# Altium schematic sheet Controller.SchDoc
size A; SheetNumber: 2; SheetTotal: 4
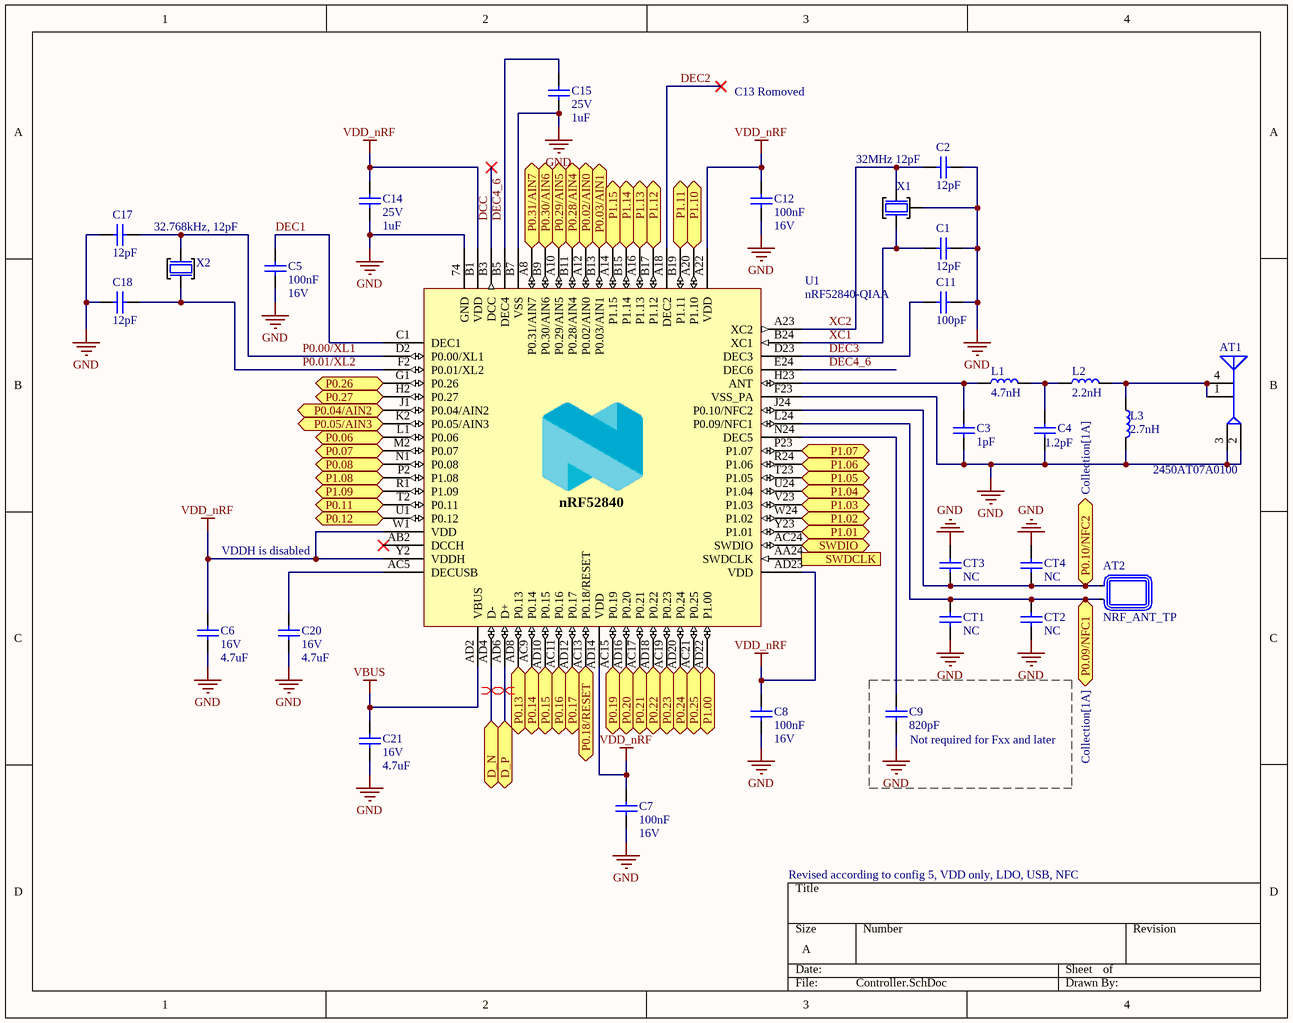
[diagram p0: Controller.SchDoc]

## Parts
AT1  2450AT07A0100  [2450AT07A0100-Footprint-1]
AT2  NRF_ANT_TP  [NRF_ANT_TP-Footprint-1]
C1  value 12pF  [0402_C]  (hidden comment: 12pF (120) 5% 50V)
C2  value 12pF  [0402_C]  (hidden comment: 12pF (120) 5% 50V)
C3  value 1pF  [0402_C]  (hidden comment: 1pF (1R0) 0.25pF 50V)
C4  value 1.2pF  [0402_C]  (hidden comment: 1.2pF (1R2) 50V)
C5  value 100nF  Voltage: 16V  [0402_C]  (hidden comment: 100nF (104) 10% 16V)
C6  value 4.7uF  Voltage: 16V  [0603_C]  (hidden comment: 4.7uF (475) 10% 16V)
C7  value 100nF  Voltage: 16V  [0402_C]  (hidden comment: 100nF (104) 10% 16V)
C8  value 100nF  Voltage: 16V  [0402_C]  (hidden comment: 100nF (104) 10% 16V)
C9  value 820pF  [0402_C]  (hidden comment: 820pF (821) 10% 50V)
C11  value 100pF  [0402_C]  (hidden comment: 100pF (101) 5% 50V)
C12  value 100nF  Voltage: 16V  [0402_C]  (hidden comment: 100nF (104) 10% 16V)
C14  value 1uF  Voltage: 25V  [0402_C]  (hidden comment: 1uF (105) 10% 25V)
C15  value 1uF  Voltage: 25V  [0402_C]  (hidden comment: 1uF (105) 10% 25V)
C17  value 12pF  [0402_C]  (hidden comment: 12pF (120) 5% 50V)
C18  value 12pF  [0402_C]  (hidden comment: 12pF (120) 5% 50V)
C20  value 4.7uF  Voltage: 16V  [0603_C]  (hidden comment: 4.7uF (475) 10% 16V)
C21  value 4.7uF  Voltage: 16V  [0603_C]  (hidden comment: 4.7uF (475) 10% 16V)
CT1  NC  [0402_C]
CT2  NC  [0402_C]
CT3  NC  [0402_C]
CT4  NC  [0402_C]
L1  4.7nH  [0402_L]
L2  2.2nH  [0402_L]
L3  2.7nH  [0402_L]
U1  nRF52840-QIAA  [AQFN50P700X700X85_HS-74N]
X1  32MHz 12pF  [XTAL_2016_4P]
X2  32.768kHz, 12pF  [XTAL_2012_2P]

## Blocks framed on the sheet
Not required for Fxx and later: C9

## Ports
D_N (bidir, see Collection[2D]), D_P (bidir, see Collection[2D]), P0.02/AIN0 (bidir, see Collection[1A]), P0.03/AIN1 (bidir, see Collection[1A]), P0.04/AIN2 (bidir, see Collection[1A]), P0.05/AIN3 (bidir, see Collection[1A]), P0.06 (bidir, see Collection[1A], Interface[4C]), P0.07 (bidir, see Collection[1A]), P0.08 (bidir, see Collection[1A], Interface[2C]), P0.09/NFC1 (bidir, see Collection[1A]), P0.10/NFC2 (bidir, see Collection[1A]), P0.11 (bidir, see Collection[1A]), P0.12 (bidir, see Collection[1A]), P0.13 (bidir, see Collection[1A]), P0.14 (bidir, see Collection[1B]), P0.15 (bidir, see Collection[1B]), P0.16 (bidir, see Collection[1B]), P0.17 (bidir, see Collection[1B]), P0.18/RESET (bidir, see Collection[2D], Interface[1D]), P0.19 (bidir, see Collection[1B]), P0.20 (bidir, see Collection[1B]), P0.21 (bidir, see Collection[1B]), P0.22 (bidir, see Collection[1B]), P0.23 (bidir, see Collection[1B]), P0.24 (bidir, see Collection[1B]), P0.25 (bidir, see Collection[1B]), P0.26 (bidir, see Collection[1B], Interface[4C]), P0.27 (bidir, see Collection[1B]), P0.28/AIN4 (bidir, see Collection[1B]), P0.29/AIN5 (bidir, see Collection[1B]), P0.30/AIN6 (bidir, see Collection[1B]), P0.31/AIN7 (bidir, see Collection[1B]), P1.00 (bidir, see Collection[1C]), P1.01 (bidir, see Collection[1C]), P1.02 (bidir, see Collection[1C]), P1.03 (bidir, see Collection[1C]), P1.04 (bidir, see Collection[1C]), P1.05 (bidir, see Collection[1C]), P1.06 (bidir, see Collection[1C]), P1.07 (bidir, see Collection[1C]), P1.08 (bidir, see Collection[1C]), P1.09 (bidir, see Collection[1C]), P1.10 (bidir, see Collection[1C]), P1.11 (bidir, see Collection[1C]), P1.12 (bidir, see Collection[1C]), P1.13 (bidir, see Collection[1C]), P1.14 (bidir, see Collection[1C], Interface[2D]), P1.15 (bidir, see Collection[1C]), SWDCLK (in, see Collection[2D], Interface[4C]), SWDIO (bidir, see Collection[2D], Interface[4C])

## Nets
GND: AT1.2 AT1.3 C1.2 C2.2 C3.1 C4.1 C5.1 C6.1 C7.1 C8.1 C9.1 C11.2 C12.1 C14.1 C15.1 C17.1 C18.1 C20.1 C21.1 CT1.1 CT2.1 CT3.2 CT4.2 L3.2 U1.74(GND) U1.B7(VSS) U1.F23(VSS_PA) X1.2(GND)
VBUS: C21.2 U1.AD2(VBUS)
VDD_nRF: C6.2 C7.2 C8.2 C12.2 C14.2 U1.A22(VDD) U1.AD14(VDD) U1.AD23(VDD) U1.B1(VDD) U1.W1(VDD) U1.Y2(VDDH)
D_N: U1.AD4(D-) ; port D_N
D_P: U1.AD6(D+) ; port D_P
DCC: U1.B3(DCC)
DEC1: C5.2 U1.C1(DEC1)
DEC2: U1.A18(DEC2)
DEC3: C11.1 U1.D23(DEC3)
DEC4_6: C15.2 U1.B5(DEC4) U1.E24(DEC6)
P0.00/XL1: C17.2 U1.D2(P0.00/XL1) X2.2(OUT)
P0.01/XL2: C18.2 U1.F2(P0.01/XL2) X2.1(IN)
P0.02/AIN0: U1.A12(P0.02/AIN0) ; port P0.02/AIN0
P0.03/AIN1: U1.B13(P0.03/AIN1) ; port P0.03/AIN1
P0.04/AIN2: U1.J1(P0.04/AIN2) ; port P0.04/AIN2
P0.05/AIN3: U1.K2(P0.05/AIN3) ; port P0.05/AIN3
P0.06: U1.L1(P0.06) ; port P0.06
P0.07: U1.M2(P0.07) ; port P0.07
P0.08: U1.N1(P0.08) ; port P0.08
P0.09/NFC1: AT2.2 CT1.2 CT2.2 U1.L24(P0.09/NFC1) ; port P0.09/NFC1
P0.10/NFC2: AT2.1 CT3.1 CT4.1 U1.J24(P0.10/NFC2) ; port P0.10/NFC2
P0.11: U1.T2(P0.11) ; port P0.11
P0.12: U1.U1(P0.12) ; port P0.12
P0.13: U1.AD8(P0.13) ; port P0.13
P0.14: U1.AC9(P0.14) ; port P0.14
P0.15: U1.AD10(P0.15) ; port P0.15
P0.16: U1.AC11(P0.16) ; port P0.16
P0.17: U1.AD12(P0.17) ; port P0.17
P0.18/RESET: U1.AC13(P0.18/RESET) ; port P0.18/RESET
P0.19: U1.AC15(P0.19) ; port P0.19
P0.20: U1.AD16(P0.20) ; port P0.20
P0.21: U1.AC17(P0.21) ; port P0.21
P0.22: U1.AD18(P0.22) ; port P0.22
P0.23: U1.AC19(P0.23) ; port P0.23
P0.24: U1.AD20(P0.24) ; port P0.24
P0.25: U1.AC21(P0.25) ; port P0.25
P0.26: U1.G1(P0.26) ; port P0.26
P0.27: U1.H2(P0.27) ; port P0.27
P0.28/AIN4: U1.B11(P0.28/AIN4) ; port P0.28/AIN4
P0.29/AIN5: U1.A10(P0.29/AIN5) ; port P0.29/AIN5
P0.30/AIN6: U1.B9(P0.30/AIN6) ; port P0.30/AIN6
P0.31/AIN7: U1.A8(P0.31/AIN7) ; port P0.31/AIN7
P1.00: U1.AD22(P1.00) ; port P1.00
P1.01: U1.Y23(P1.01) ; port P1.01
P1.02: U1.W24(P1.02) ; port P1.02
P1.03: U1.V23(P1.03) ; port P1.03
P1.04: U1.U24(P1.04) ; port P1.04
P1.05: U1.T23(P1.05) ; port P1.05
P1.06: U1.R24(P1.06) ; port P1.06
P1.07: U1.P23(P1.07) ; port P1.07
P1.08: U1.P2(P1.08) ; port P1.08
P1.09: U1.R1(P1.09) ; port P1.09
P1.10: U1.A20(P1.10) ; port P1.10
P1.11: U1.B19(P1.11) ; port P1.11
P1.12: U1.B17(P1.12) ; port P1.12
P1.13: U1.A16(P1.13) ; port P1.13
P1.14: U1.B15(P1.14) ; port P1.14
P1.15: U1.A14(P1.15) ; port P1.15
SWDCLK: U1.AA24(SWDCLK) ; port SWDCLK
SWDIO: U1.AC24(SWDIO) ; port SWDIO
XC1: C1.1 U1.B24(XC1) X1.1(IN)
XC2: C2.1 U1.A23(XC2) X1.3(OUT)
NetAT1_1: AT1.1 AT1.4 L2.2 L3.1
NetC3_2: C3.2 L1.1 U1.H23(ANT)
NetC4_2: C4.2 L1.2 L2.1
NetC9_2: C9.2 U1.N24(DEC5)
NetC20_2: C20.2 U1.AC5(DECUSB)

Not connected (* = marked no-connect by the designer): U1 AB2(DCCH)*

## Layout directives
differential pair: D_N, D_P

## Notes on the sheet
- C13 Romoved
- VDDH is disabled
- Revised according to config 5, VDD only, LDO, USB, NFC
- (in symbol nRF52840-QIAA) nRF52840

## Library data of the parts
AT1 = CMP-00025-00003-1: 2.4GHz Chip RF Antenna 2.4GHz ~ 2.5GHz 1dBi Solder Surface Mount; Impedance: 50Ω; Max Operating Temperature: 125°C; Frequency: 2.4GHz; Pins: 4; RoHS Compliant: Yes; Min Operating Temperature: -40°C; Mounting Technology: SMD
AT2 = CMP-00025-00004-1: NRF Antenna Testpoint; Pins: 2
C1 C2 C17 C18 = 0402 12pF (120) 5% 50V: Chip Capacitor; Package: 0402; Voltage: 50V
C3 = 0402 1pF (1R0) 0.25pF 50V: Chip Capacitor; Voltage: 50V
C4 = 0402 1.2pF (1R2) 50V: Chip Capacitor; Voltage: 50V
C5 C7 C8 C12 = 0402 100nF (104) 10% 16V: Chip Capacitor
C6 C20 C21 = 0603 4.7uF (475) 10% 16V: Chip Capacitor; ComponentLink1Description: 供应商链接; ComponentLink1URL: http://www.szlcsc.com/product/details_20375.html; Package: 0603
C9 = 0402 820pF (821) 10% 50V: Chip Capacitor; Voltage: 50V
C11 = 0402 100pF (101) 5% 50V: Chip Capacitor; Voltage: 50V
C14 C15 = 0402 1uF (105) 10% 25V: Chip Capacitor
CT1-CT4 = 0402 Capacitor Testpoint: Chip Capacitor Testpoint; Value: NC
L1 = 0402 4.7nH 0.3nH: Chip Inductor; ComponentLink1Description: 供应商链接; ComponentLink1URL: http://www.szlcsc.com/product/details_14246.html; Value: 4.7nH
L2 = 0402 2.2nH: Chip Inductor; Value: 2.2nH
L3 = 0402 2.7nH 0.3nH: Chip Inductor; Value: 2.7nH
U1 = nRF52840-QIAA: Multi-protocol Bluetooth Low Energy, IEEE 802.15.4, ANT and 2.4GHz proprietary system-on-chip; Pad Count: 73; Part Number: nRF52840-QIAA; LatestRevisionDate: 2017-08-21; Published: 2017-08-21; Value: nRF52840-QIAA; Footprint Doc: AQFN-73
X1 = XTAL_SMD2016_32MHz_12pF: XTAL SMD 2016, 32MHz, Cl=12pF, Total Tol: ±20ppm; Frequency: 32MHz; Pins: 4
X2 = XTAL_SMD2012_32.768kHz_12pF: 32.768kHz 12pF ±20ppm SMD2012-2P  Crystals ROHS; Pad Count: 2; Frequency: 32.768kHz; Component Class: Oscillators